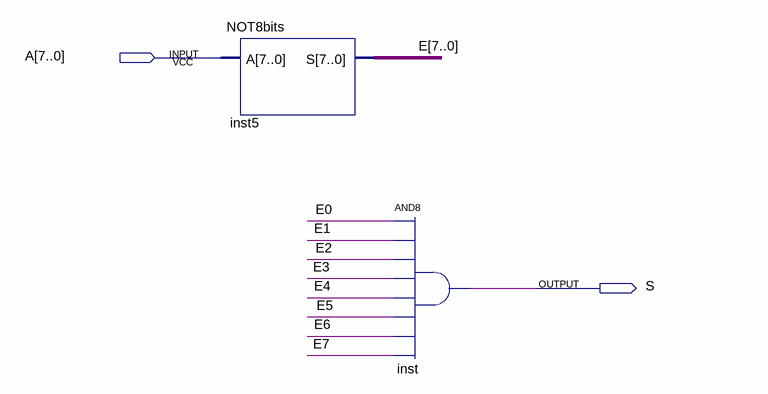
[diagram p0: schematic sheet]
// Quartus schematic ZERO.bdf as structural Verilog: 2 symbols, 2 pins
module ZERO (
  input  [7:0] A,
  output S
);

  wire [7:0] E;

  NOT8bits inst5 (.A(A), .S(E));
  and inst (S, E[0], E[1], E[2], E[3], E[4], E[5], E[6], E[7]);
endmodule
